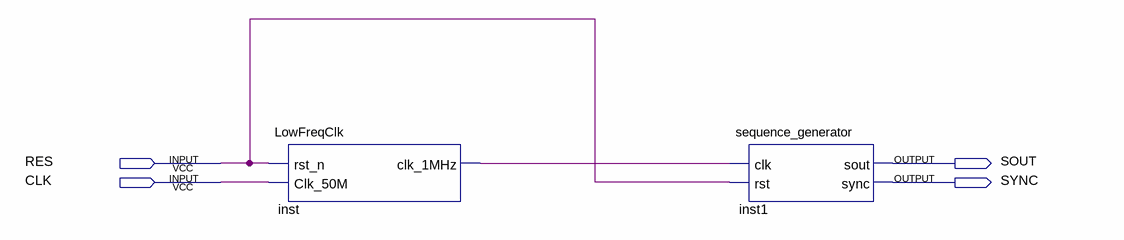
[diagram p0: schematic sheet]
// Quartus schematic THR2023063114.bdf as structural Verilog: 2 symbols, 4 pins
module THR2023063114 (
  input  RES,
  input  CLK,
  output SOUT,
  output SYNC
);

  wire inst_clk_1mhz;

  LowFreqClk inst (.rst_n(RES), .Clk_50M(CLK), .clk_1MHz(inst_clk_1mhz));
  sequence_generator inst1 (.clk(inst_clk_1mhz), .rst(RES), .sout(SOUT), .sync(SYNC));
endmodule
